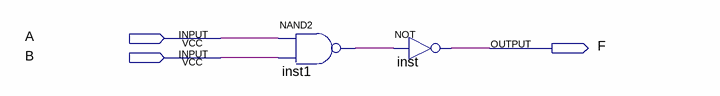
[diagram p0: schematic sheet]
// Quartus schematic YFM.bdf as structural Verilog: 2 symbols, 3 pins
module YFM (
  input  A,
  input  B,
  output F
);

  wire inst1_out;

  nand inst1 (inst1_out, A, B);
  not inst (F, inst1_out);
endmodule
